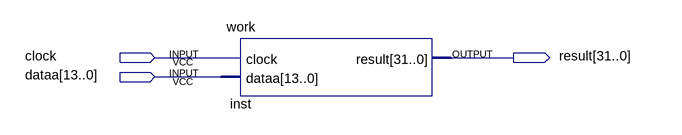
[diagram p0: schematic sheet]
// Quartus schematic ISWEARTOCHRIST.bdf as structural Verilog: 1 symbols, 3 pins
module ISWEARTOCHRIST (
  input  clock,
  input  [13:0] dataa,
  output [31:0] result
);

  work inst (.clock(clock), .dataa(dataa), .result(result));
endmodule
